# Altium project PCB_Project.PrjPcb
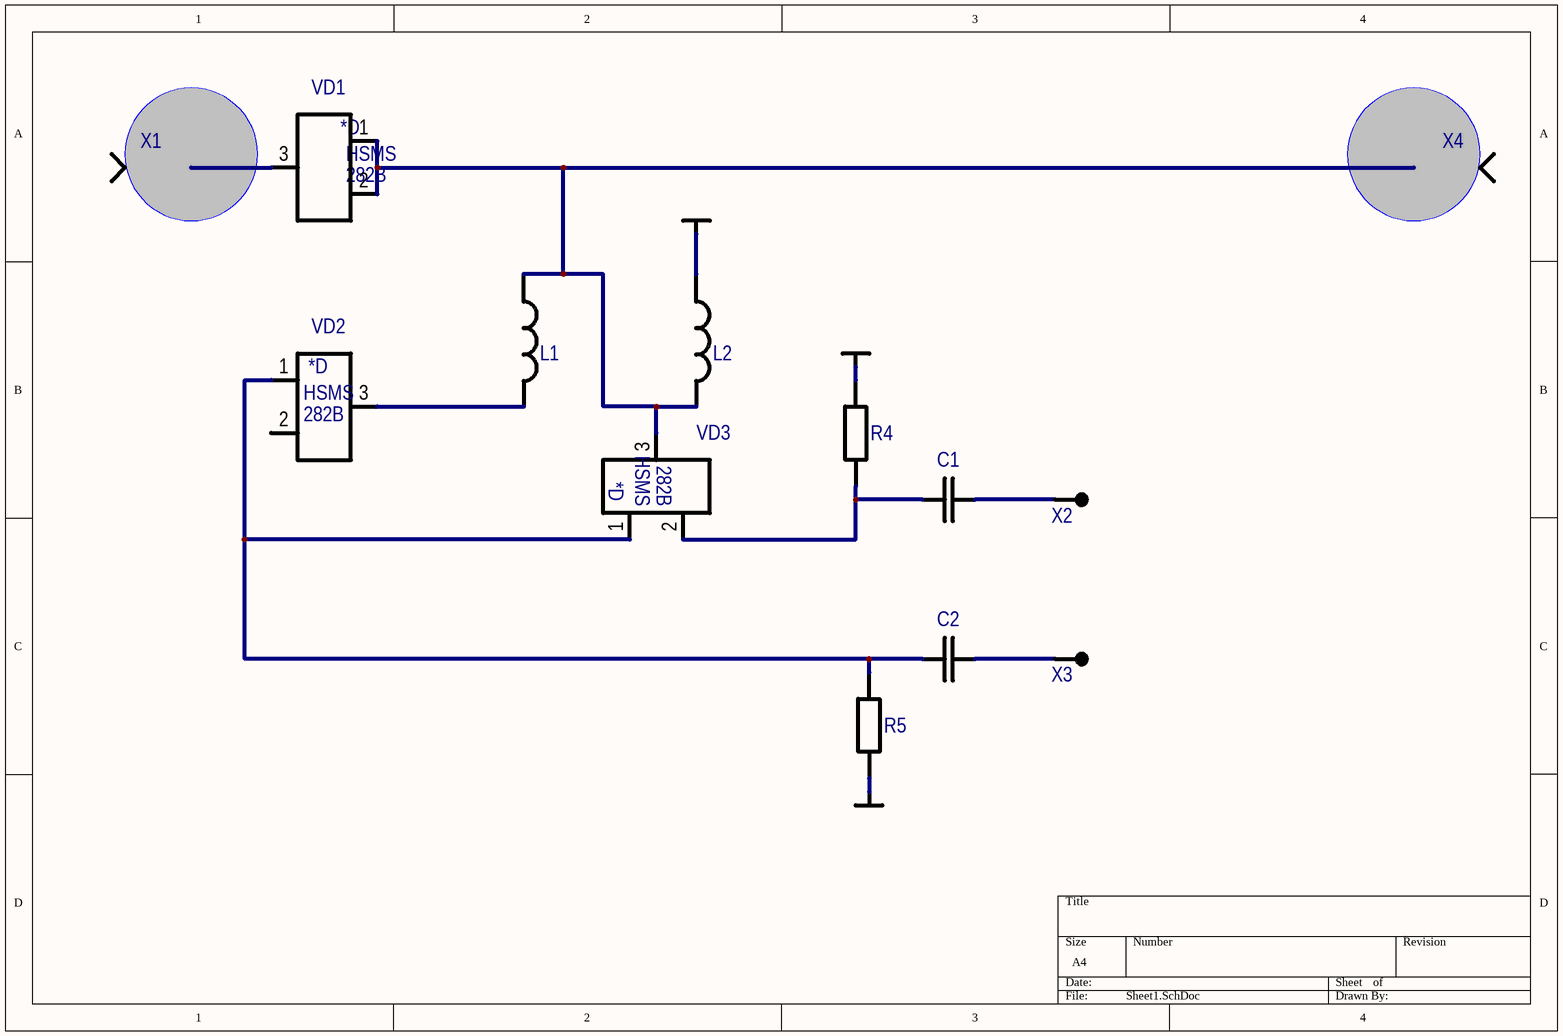
[diagram p0: Sheet1.SchDoc]
1 sheet, 16 parts. Net scope: global (net labels, ports and power ports of the same name join across sheets).
Board file: 0172 F.PcbDoc

## Sheet Sheet1.SchDoc
size A4

### Parts
(Parts that share a designator on the sheet are numbered #1, #2 ... from top to bottom, then left to right.)
*#1  GND  (value not drawn)  (graphical)
*#2  GND  (value not drawn)  (graphical)
*#3  GND  (value not drawn)  (graphical)
C1  0,1 мк  [CAPC1005L]  (value not drawn)
C2  0,1 мк  [CAPC1005L]  (value not drawn)
L1  12  [INDC1608L]  (value not drawn)
L2  12  [INDC1608L]  (value not drawn)
R4  100  [RESC1608L]  (value not drawn)
R5  100  [RESC1608L]  (value not drawn)
VD1  HSMS-282B  [SOT65P210X110-3N]  (value not drawn)
VD2  HSMS-282B  [SOT65P210X110-3N]  (value not drawn)
VD3  HSMS-282B  [SOT65P210X110-3N]  (value not drawn)
X1  СРГ-50-884ФВ  [TP0.8X1.5]  (value not drawn)
X2  ИСПП-1а-250-3,0-1,5  [TP1]  (value not drawn)
X3  ИСПП-1а-250-3,0-1,5  [TP1]  (value not drawn)
X4  СРГ-50-884ФВ  [TP0.8X1.5]  (value not drawn)

### Nets
GND: L2.1 R4.2 R5.1
NetC1_1: C1.1 X2.1
NetC1_2: C1.2 R4.1 VD3.2(NC)
NetC2_1: C2.1 X3.1
NetC2_2: C2.2 R5.2 VD2.1(Anode) VD3.1(Anode)
NetL1_1: L1.1 L2.2 VD1.1(Anode) VD1.2(NC) VD3.3(Cathode) X4.1
NetL1_2: L1.2 VD2.3(Cathode)
NetVD1_3: VD1.3(Cathode) X1.1

Not connected (* = marked no-connect by the designer): VD2 2(NC)

### Notes on the sheet
- (in symbol HSMS-282B) *D; HSMS; 282B

### Library data of the parts
*#1-*#3 = GND: Корпус ЕСКД. Для "наложения" на штатный Power Bar
C1 C2 = i6124B5A087044000001: Чип-конденсатор; ManufacturerPartNumber: 0402 X5R 0,1 мкФ ±10 % 10 В; Name: 0402; Power/Voltage: 10 В; TKE/TKC: {TKE/TKC}; Tolerance: ±10 %; PCADSymbol: C; PCADLibrary: PASSIV.LIB; BCPId: *; Manufacturer: *; Type: Конденсатор; Value: 0,1 мк; ImKey: i6124B5A087044000001; PCADType: C0402; PCADPattern: C0402
L1 L2 = i6124B5A087077000011: Индуктивность без магнитопровода; ManufacturerPartNumber: 0603CS-12NXJE (12 нГн ±5 %); Name: 0603; Tolerance: ±5 %; PCADType: L-0603; PCADSymbol: INDUCT; PCADPattern: L0603M; PCADLibrary: PASSIV.LIB; BCPId: *; Manufacturer: *; Package: *; Type: Индуктивность; Value: 12; ImKey: i6124B5A087077000011
R4 R5 = i6124B5A08707A000021: Чип-резистор; ManufacturerPartNumber: Р1-12-0,1-100 Ом ±5 % - Т; Name: 0603; Tolerance: ±5 %; Power/Voltage: 0,1 Вт; TU/GOST: АЛЯР.434110.005 ТУ; BCPId: *; Manufacturer: *; Type: Резистор; Value: 100; ImKey: i6124B5A08707A000021
VD1-VD3 = HSMS-282B: RF Schottky Barrier Diodes; Manufacturer*: AVAGO Technologies; Type: Микросхема; BCPId: *; ManufacturerPartNumber: HSMS-282B; Package: SOT-323
X1 X4 = СРГ-50-884ФВ: Переход коаксиально-полосковый герметичный; TU/GOST: ВРО.364.039 ТУ; SymAuthor: Календарова В.; BCPId: *; Name: *; ManufacturerPartNumber: СРГ-50-884ФВ; Type: Переход
X2 X3 = ИСПП: Изолятор стеклянный пресованный проходной; TU/GOST: СКНЦ.552327.191 ТУ; BCPId: *; Name: *; ManufacturerPartNumber: ИСПП-1а-250-3,0-1,5; Type: Изолятор